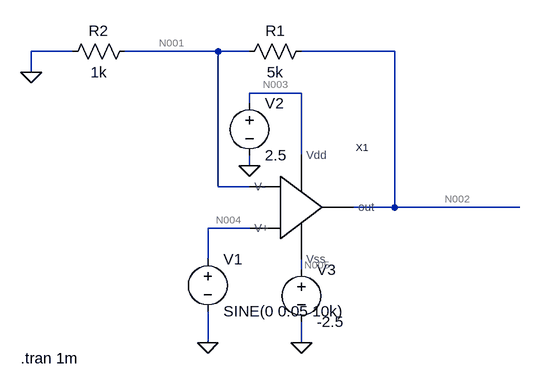
[diagram p0: schematic 2a.asc]
2a.asc, the LTspice schematic file:
Version 4
SHEET 1 880 680
WIRE -192 -144 -256 -144
WIRE 32 -144 -112 -144
WIRE 80 -144 32 -144
WIRE 304 -144 160 -144
WIRE -256 -112 -256 -144
WIRE 160 -80 80 -80
WIRE 80 -64 80 -80
WIRE 160 16 160 -80
WIRE 80 32 80 16
WIRE 32 64 32 -144
WIRE 80 64 32 64
WIRE 304 96 304 -144
WIRE 304 96 240 96
WIRE 496 96 304 96
WIRE 80 128 16 128
WIRE 16 176 16 128
WIRE 160 192 160 176
WIRE 16 304 16 256
WIRE 160 304 160 272
FLAG 16 304 0
FLAG 160 304 0
FLAG 80 32 0
FLAG -256 -112 0
SYMBOL res 176 -160 R90
WINDOW 0 0 56 VBottom 2
WINDOW 3 32 56 VTop 2
SYMATTR InstName R1
SYMATTR Value 5k
SYMBOL voltage 16 160 R0
WINDOW 123 0 0 Left 0
WINDOW 39 0 0 Left 0
SYMATTR InstName V1
SYMATTR Value SINE(0 0.05 10k)
SYMBOL voltage 80 -80 R0
WINDOW 123 0 0 Left 0
WINDOW 39 0 0 Left 0
SYMATTR InstName V2
SYMATTR Value 2.5
SYMBOL voltage 160 176 R0
WINDOW 123 0 0 Left 0
WINDOW 39 0 0 Left 0
SYMATTR InstName V3
SYMATTR Value -2.5
SYMBOL res -96 -160 R90
WINDOW 0 0 56 VBottom 2
WINDOW 3 32 56 VTop 2
SYMATTR InstName R2
SYMATTR Value 1k
SYMBOL OPAMP 48 96 R0
SYMATTR InstName X1
TEXT -272 328 Left 2 !.tran 1m

The netlist it stands for:
* 2a.asc
R1 N002 N001 5k
V1 N004 0 SINE(0 0.05 10k)
V2 N003 0 2.5
V3 N005 0 -2.5
R2 N001 0 1k
XX1 N003 N005 N001 N004 N002 OPAMP  ; pins Vdd Vss V- V+ out
.tran 1m
.backanno
.end

* Results of the author's LTspice run, read from the files saved beside the schematic
* Operating Point, zero values left out:
*   V(n002) = 285.5 µV
*   V(n001) = 47.58 µV
*   V(n003) = 2.5 V
*   V(n005) = -2.5 V
*   I(R1) = 47.58 nA
*   I(R2) = 47.58 nA
*   I(V2) = -188.5 µA
*   I(V3) = 188.4 µA
*   Ix(x1:VDD) = 188.5 µA
*   Ix(x1:VSS) = -188.4 µA
*   Ix(x1:OUT) = -47.58 nA
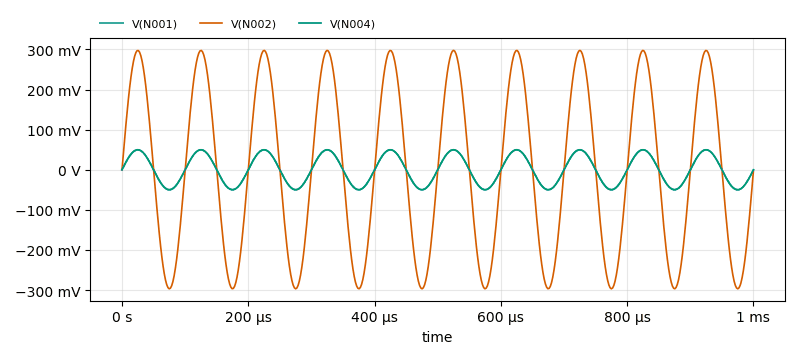
[diagram p1: Transient Analysis of 2a.asc, plotted from the saved traces]
* Transient Analysis, 1 run:
*   V(N001): min -49.47 mV, max 49.63 mV, average 65.42 µV, rms 35.04 mV, last -450.2 µV
*   V(N002): min -296.8 mV, max 297.8 mV, average 392.5 µV, rms 210.2 mV, last -2.701 mV
*   V(N004): min -50 mV, max 50 mV, average -40 nV, rms 35.36 mV, last 0 V